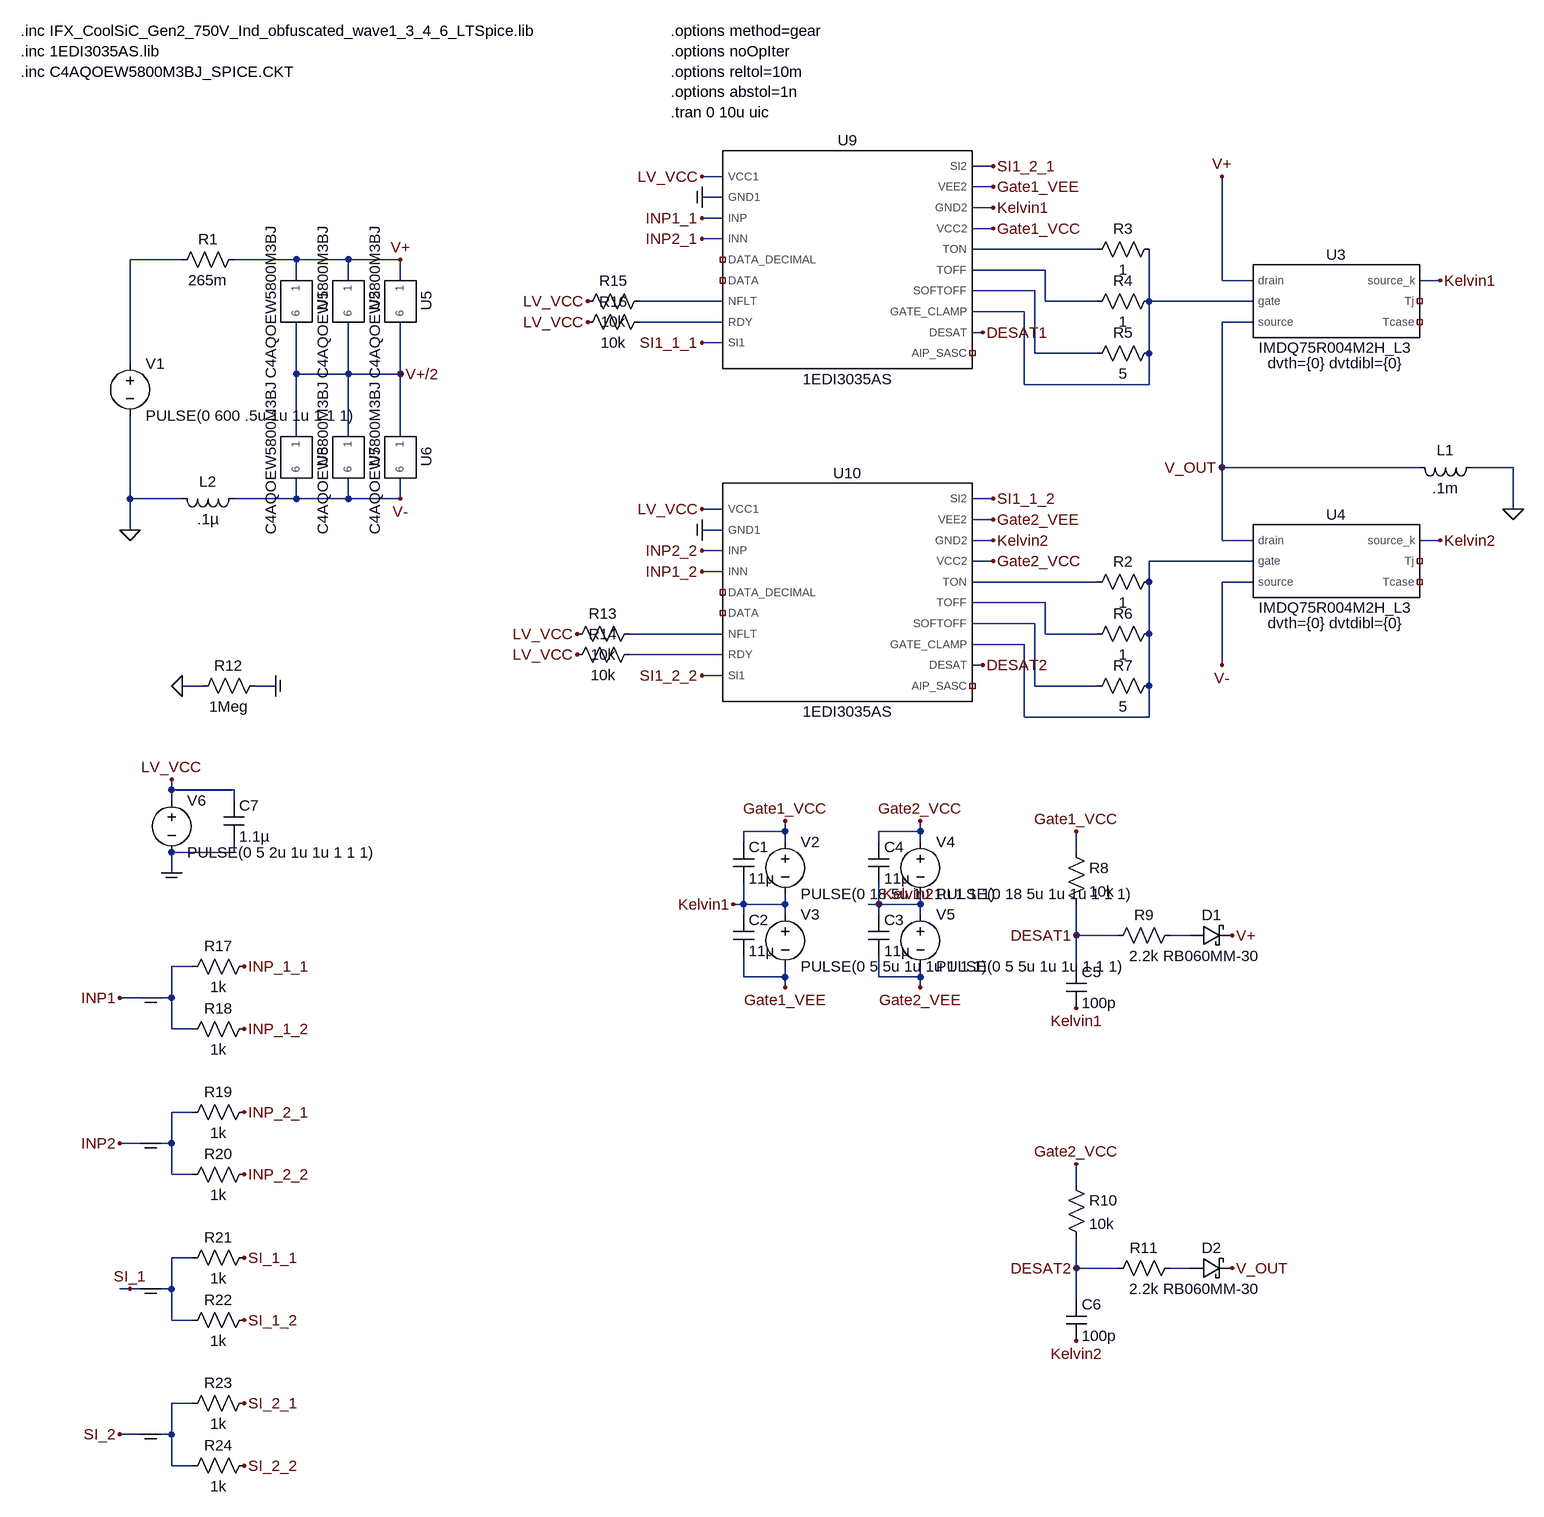
[diagram p0: schematic PowerSim.asc]
PowerSim.asc, the LTspice schematic file:
Version 4
SHEET 1 1312 2000
WIRE 496 -48 464 -48
WIRE 80 -32 48 -32
WIRE 496 -16 464 -16
WIRE 80 0 48 0
WIRE 496 16 464 16
WIRE 80 32 48 32
WIRE 496 48 464 48
WIRE 80 64 48 64
WIRE 656 80 464 80
WIRE -752 96 -832 96
WIRE -576 96 -672 96
WIRE -496 96 -576 96
WIRE -416 96 -496 96
WIRE 576 112 464 112
WIRE -576 128 -576 96
WIRE -496 128 -496 96
WIRE -416 128 -416 96
WIRE 848 128 848 -32
WIRE 896 128 848 128
WIRE 1184 128 1152 128
WIRE 560 144 464 144
WIRE 80 160 -48 160
WIRE 576 160 576 112
WIRE 656 160 576 160
WIRE 736 160 736 80
WIRE 896 160 736 160
WIRE 544 176 464 176
WIRE 80 192 -48 192
WIRE 896 192 848 192
WIRE 480 208 464 208
WIRE 80 224 48 224
WIRE 560 240 560 144
WIRE 656 240 560 240
WIRE 736 240 736 160
WIRE -832 256 -832 96
WIRE -576 272 -576 192
WIRE -496 272 -496 192
WIRE -496 272 -576 272
WIRE -416 272 -416 192
WIRE -416 272 -496 272
WIRE 544 288 544 176
WIRE 736 288 736 240
WIRE 736 288 544 288
WIRE -576 368 -576 272
WIRE -496 368 -496 272
WIRE -416 368 -416 272
WIRE 848 416 848 192
WIRE 1152 416 848 416
WIRE 1296 416 1232 416
WIRE -832 464 -832 336
WIRE -752 464 -832 464
WIRE -576 464 -576 432
WIRE -576 464 -672 464
WIRE -496 464 -496 432
WIRE -496 464 -576 464
WIRE -416 464 -416 432
WIRE -416 464 -496 464
WIRE 496 464 464 464
WIRE 80 480 48 480
WIRE 1296 480 1296 416
WIRE 496 496 464 496
WIRE -832 512 -832 464
WIRE 80 512 48 512
WIRE 496 528 464 528
WIRE 848 528 848 416
WIRE 896 528 848 528
WIRE 1184 528 1152 528
WIRE 80 544 48 544
WIRE 496 560 464 560
WIRE 896 560 736 560
WIRE 80 576 48 576
WIRE 656 592 464 592
WIRE 736 592 736 560
WIRE 896 592 848 592
WIRE 576 624 464 624
WIRE 560 656 464 656
WIRE 80 672 -64 672
WIRE 576 672 576 624
WIRE 656 672 576 672
WIRE 736 672 736 592
WIRE 544 688 464 688
WIRE 80 704 -64 704
WIRE 480 720 464 720
WIRE 848 720 848 592
WIRE 80 736 48 736
WIRE -720 752 -752 752
WIRE -608 752 -640 752
WIRE 560 752 560 656
WIRE 656 752 560 752
WIRE 736 752 736 672
WIRE 544 800 544 688
WIRE 736 800 736 752
WIRE 736 800 544 800
WIRE -768 912 -768 896
WIRE -672 912 -768 912
WIRE -768 928 -768 912
WIRE -672 928 -672 912
WIRE 176 976 176 960
WIRE 176 976 112 976
WIRE 384 976 384 960
WIRE 384 976 320 976
WIRE 112 992 112 976
WIRE 176 992 176 976
WIRE 320 992 320 976
WIRE 384 992 384 976
WIRE -672 1008 -672 992
WIRE -672 1008 -768 1008
WIRE 624 1008 624 976
WIRE -768 1040 -768 1008
WIRE 112 1088 112 1056
WIRE 112 1088 96 1088
WIRE 176 1088 176 1072
WIRE 176 1088 112 1088
WIRE 320 1088 320 1056
WIRE 320 1088 304 1088
WIRE 384 1088 384 1072
WIRE 384 1088 320 1088
WIRE 112 1104 112 1088
WIRE 176 1104 176 1088
WIRE 320 1104 320 1088
WIRE 384 1104 384 1088
WIRE 624 1136 624 1088
WIRE 688 1136 624 1136
WIRE 800 1136 768 1136
WIRE -736 1184 -768 1184
WIRE 624 1184 624 1136
WIRE 112 1200 112 1168
WIRE 176 1200 176 1184
WIRE 176 1200 112 1200
WIRE 320 1200 320 1168
WIRE 384 1200 384 1184
WIRE 384 1200 320 1200
WIRE 176 1216 176 1200
WIRE 384 1216 384 1200
WIRE -800 1232 -848 1232
WIRE -768 1232 -768 1184
WIRE -768 1232 -800 1232
WIRE -768 1280 -768 1232
WIRE -736 1280 -768 1280
WIRE -736 1408 -768 1408
WIRE -800 1456 -848 1456
WIRE -768 1456 -768 1408
WIRE -768 1456 -800 1456
WIRE -768 1504 -768 1456
WIRE -736 1504 -768 1504
WIRE 624 1520 624 1488
WIRE -736 1632 -768 1632
WIRE 624 1648 624 1600
WIRE 688 1648 624 1648
WIRE 800 1648 768 1648
WIRE -832 1680 -848 1680
WIRE -800 1680 -832 1680
WIRE -768 1680 -768 1632
WIRE -768 1680 -800 1680
WIRE 624 1696 624 1648
WIRE -768 1728 -768 1680
WIRE -736 1728 -768 1728
WIRE -736 1856 -768 1856
WIRE -800 1904 -848 1904
WIRE -768 1904 -768 1856
WIRE -768 1904 -800 1904
WIRE -768 1952 -768 1904
WIRE -736 1952 -768 1952
FLAG -832 512 0
FLAG 1296 480 0
FLAG -416 96 V+
FLAG -416 464 V-
FLAG 848 -32 V+
FLAG 848 720 V-
FLAG -416 272 V+/2
FLAG 48 32 INP1_1
FLAG 48 544 INP2_2
FLAG 48 576 INP1_2
FLAG 48 64 INP2_1
FLAG 48 736 SI1_2_2
FLAG 48 224 SI1_1_1
FLAG 496 464 SI1_1_2
FLAG 496 -48 SI1_2_1
FLAG 1184 128 Kelvin1
FLAG 1184 528 Kelvin2
FLAG 496 528 Kelvin2
FLAG 496 16 Kelvin1
FLAG 496 48 Gate1_VCC
FLAG 496 -16 Gate1_VEE
FLAG 496 496 Gate2_VEE
FLAG 496 560 Gate2_VCC
FLAG 96 1088 Kelvin1
FLAG 320 1088 Kelvin2
FLAG 176 960 Gate1_VCC
FLAG 176 1216 Gate1_VEE
FLAG 384 960 Gate2_VCC
FLAG 384 1216 Gate2_VEE
FLAG 624 976 Gate1_VCC
FLAG 624 1248 Kelvin1
FLAG 864 1136 V+
FLAG 624 1488 Gate2_VCC
FLAG 624 1760 Kelvin2
FLAG 864 1648 V_OUT
FLAG 480 208 DESAT1
FLAG 480 720 DESAT2
FLAG 624 1136 DESAT1
FLAG 624 1648 DESAT2
FLAG 848 416 V_OUT
FLAG 48 512 COM
FLAG 48 0 COM
FLAG -752 752 0
FLAG -608 752 COM
FLAG 48 -32 LV_VCC
FLAG 48 480 LV_VCC
FLAG -768 896 LV_VCC
FLAG -768 1040 COM
FLAG -144 672 LV_VCC
FLAG -144 704 LV_VCC
FLAG -128 160 LV_VCC
FLAG -128 192 LV_VCC
FLAG -656 1184 INP_1_1
FLAG -656 1280 INP_1_2
FLAG -656 1408 INP_2_1
FLAG -656 1504 INP_2_2
FLAG -656 1632 SI_1_1
FLAG -656 1728 SI_1_2
FLAG -656 1856 SI_2_1
FLAG -656 1952 SI_2_2
FLAG -848 1232 INP1
FLAG -848 1456 INP2
FLAG -832 1680 SI_1
FLAG -848 1904 SI_2
FLAG -800 1232 COM
FLAG -800 1456 COM
FLAG -800 1680 COM
FLAG -800 1904 COM
SYMBOL voltage -832 240 R0
SYMATTR InstName V1
SYMATTR Value PULSE(0 600 .5u 1u 1u 1 1 1)
SYMBOL Infineon-SiCFETs/IMDQ75R004M2H_L3 1024 160 R0
SYMATTR InstName U3
SYMBOL Infineon-SiCFETs/IMDQ75R004M2H_L3 1024 560 R0
SYMATTR InstName U4
SYMBOL ind 1248 400 R90
WINDOW 0 5 56 VBottom 2
WINDOW 3 32 56 VTop 2
SYMATTR InstName L1
SYMATTR Value .1m
SYMATTR SpiceLine Rser=.1m
SYMBOL AutoGenerated/C4AQOEW5800M3BJ -576 160 R90
SYMATTR InstName U1
SYMBOL AutoGenerated/C4AQOEW5800M3BJ -496 160 R90
SYMATTR InstName U2
SYMBOL AutoGenerated/C4AQOEW5800M3BJ -416 160 R90
SYMATTR InstName U5
SYMBOL AutoGenerated/C4AQOEW5800M3BJ -416 400 R90
SYMATTR InstName U6
SYMBOL AutoGenerated/C4AQOEW5800M3BJ -496 400 R90
SYMATTR InstName U7
SYMBOL AutoGenerated/C4AQOEW5800M3BJ -576 400 R90
SYMATTR InstName U8
SYMBOL res -656 80 R90
WINDOW 0 0 56 VBottom 2
WINDOW 3 32 56 VTop 2
SYMATTR InstName R1
SYMATTR Value 265m
SYMBOL ind -656 448 R90
WINDOW 0 5 56 VBottom 2
WINDOW 3 32 56 VTop 2
SYMATTR InstName L2
SYMATTR Value .1µ
SYMBOL AutoGenerated/1EDI3035AS 272 96 R0
SYMATTR InstName U9
SYMBOL AutoGenerated/1EDI3035AS 272 608 R0
SYMATTR InstName U10
SYMBOL voltage 176 976 R0
SYMATTR InstName V2
SYMATTR Value PULSE(0 18 5u 1u 1u 1 1 1)
SYMBOL voltage 176 1088 R0
SYMATTR InstName V3
SYMATTR Value PULSE(0 5 5u 1u 1u 1 1 1)
SYMBOL voltage 384 976 R0
SYMATTR InstName V4
SYMATTR Value PULSE(0 18 5u 1u 1u 1 1 1)
SYMBOL voltage 384 1088 R0
SYMATTR InstName V5
SYMATTR Value PULSE(0 5 5u 1u 1u 1 1 1)
SYMBOL Res 752 64 R90
WINDOW 0 0 56 VBottom 2
WINDOW 3 32 56 VTop 2
SYMATTR InstName R3
SYMATTR Value 1
SYMBOL Res 752 144 R90
WINDOW 0 0 56 VBottom 2
WINDOW 3 32 56 VTop 2
SYMATTR InstName R4
SYMATTR Value 1
SYMBOL Res 752 224 R90
WINDOW 0 0 56 VBottom 2
WINDOW 3 32 56 VTop 2
SYMATTR InstName R5
SYMATTR Value 5
SYMBOL cap 96 992 R0
SYMATTR InstName C1
SYMATTR Value 11µ
SYMBOL cap 96 1104 R0
SYMATTR InstName C2
SYMATTR Value 11µ
SYMBOL cap 304 1104 R0
SYMATTR InstName C3
SYMATTR Value 11µ
SYMBOL cap 304 992 R0
SYMATTR InstName C4
SYMATTR Value 11µ
SYMBOL Res 752 576 R90
WINDOW 0 0 56 VBottom 2
WINDOW 3 32 56 VTop 2
SYMATTR InstName R2
SYMATTR Value 1
SYMBOL Res 752 656 R90
WINDOW 0 0 56 VBottom 2
WINDOW 3 32 56 VTop 2
SYMATTR InstName R6
SYMATTR Value 1
SYMBOL Res 752 736 R90
WINDOW 0 0 56 VBottom 2
WINDOW 3 32 56 VTop 2
SYMATTR InstName R7
SYMATTR Value 5
SYMBOL res 608 992 R0
SYMATTR InstName R8
SYMATTR Value 10k
SYMBOL res 784 1120 R90
WINDOW 0 0 56 VBottom 2
WINDOW 3 32 56 VTop 2
SYMATTR InstName R9
SYMATTR Value 2.2k
SYMBOL cap 608 1184 R0
SYMATTR InstName C5
SYMATTR Value 100p
SYMBOL schottky 800 1152 R270
WINDOW 0 32 32 VTop 2
WINDOW 3 0 32 VBottom 2
SYMATTR InstName D1
SYMATTR Value RB060MM-30
SYMATTR Description Diode
SYMATTR Type diode
SYMBOL res 608 1504 R0
SYMATTR InstName R10
SYMATTR Value 10k
SYMBOL res 784 1632 R90
WINDOW 0 0 56 VBottom 2
WINDOW 3 32 56 VTop 2
SYMATTR InstName R11
SYMATTR Value 2.2k
SYMBOL cap 608 1696 R0
SYMATTR InstName C6
SYMATTR Value 100p
SYMBOL schottky 800 1664 R270
WINDOW 0 32 32 VTop 2
WINDOW 3 0 32 VBottom 2
SYMATTR InstName D2
SYMATTR Value RB060MM-30
SYMATTR Description Diode
SYMATTR Type diode
SYMBOL res -624 736 R90
WINDOW 0 0 56 VBottom 2
WINDOW 3 32 56 VTop 2
SYMATTR InstName R12
SYMATTR Value 1Meg
SYMBOL voltage -768 912 R0
SYMATTR InstName V6
SYMATTR Value PULSE(0 5 2u 1u 1u 1 1 1)
SYMBOL cap -688 928 R0
SYMATTR InstName C7
SYMATTR Value 1.1µ
SYMBOL res -48 656 R90
WINDOW 0 0 56 VBottom 2
WINDOW 3 32 56 VTop 2
SYMATTR InstName R13
SYMATTR Value 10k
SYMBOL res -48 688 R90
WINDOW 0 0 56 VBottom 2
WINDOW 3 32 56 VTop 2
SYMATTR InstName R14
SYMATTR Value 10k
SYMBOL res -32 144 R90
WINDOW 0 0 56 VBottom 2
WINDOW 3 32 56 VTop 2
SYMATTR InstName R15
SYMATTR Value 10k
SYMBOL res -32 176 R90
WINDOW 0 0 56 VBottom 2
WINDOW 3 32 56 VTop 2
SYMATTR InstName R16
SYMATTR Value 10k
SYMBOL res -640 1168 R90
WINDOW 0 0 56 VBottom 2
WINDOW 3 32 56 VTop 2
SYMATTR InstName R17
SYMATTR Value 1k
SYMBOL res -640 1264 R90
WINDOW 0 0 56 VBottom 2
WINDOW 3 32 56 VTop 2
SYMATTR InstName R18
SYMATTR Value 1k
SYMBOL res -640 1392 R90
WINDOW 0 0 56 VBottom 2
WINDOW 3 32 56 VTop 2
SYMATTR InstName R19
SYMATTR Value 1k
SYMBOL res -640 1488 R90
WINDOW 0 0 56 VBottom 2
WINDOW 3 32 56 VTop 2
SYMATTR InstName R20
SYMATTR Value 1k
SYMBOL res -640 1616 R90
WINDOW 0 0 56 VBottom 2
WINDOW 3 32 56 VTop 2
SYMATTR InstName R21
SYMATTR Value 1k
SYMBOL res -640 1712 R90
WINDOW 0 0 56 VBottom 2
WINDOW 3 32 56 VTop 2
SYMATTR InstName R22
SYMATTR Value 1k
SYMBOL res -640 1840 R90
WINDOW 0 0 56 VBottom 2
WINDOW 3 32 56 VTop 2
SYMATTR InstName R23
SYMATTR Value 1k
SYMBOL res -640 1936 R90
WINDOW 0 0 56 VBottom 2
WINDOW 3 32 56 VTop 2
SYMATTR InstName R24
SYMATTR Value 1k
TEXT 0 -256 Left 2 !.options method=gear\n.options noOpIter\n.options reltol=10m\n.options abstol=1n\n.tran 0 10u uic
TEXT -1000 -256 Left 2 !.inc IFX_CoolSiC_Gen2_750V_Ind_obfuscated_wave1_3_4_6_LTSpice.lib\n.inc 1EDI3035AS.lib\n.inc C4AQOEW5800M3BJ_SPICE.CKT

The netlist it stands for:
* PowerSim.asc
V1 N002 0 PULSE(0 600 .5u 1u 1u 1 1 1)
XU3 V+ N006 V_OUT Kelvin1 NC_01 NC_02 IMDQ75R004M2H_L3 dvth={0} dvtdibl={0}  ; pins drain gate source source_k Tj Tcase
XU4 V_OUT N008 V- Kelvin2 NC_03 NC_04 IMDQ75R004M2H_L3 dvth={0} dvtdibl={0}  ; pins drain gate source source_k Tj Tcase
L1 0 V_OUT .1m Rser=.1m
XU1 V+ V+/2 C4AQOEW5800M3BJ  ; pins 1 6
XU2 V+ V+/2 C4AQOEW5800M3BJ  ; pins 1 6
XU5 V+ V+/2 C4AQOEW5800M3BJ  ; pins 1 6
XU6 V+/2 V- C4AQOEW5800M3BJ  ; pins 1 6
XU7 V+/2 V- C4AQOEW5800M3BJ  ; pins 1 6
XU8 V+/2 V- C4AQOEW5800M3BJ  ; pins 1 6
R1 V+ N002 265m
L2 V- 0 .1µ
XU9 LV_VCC SI_2 INP1_1 INP2_1 NC_05 NC_06 N005 N007 SI1_1_1 SI1_2_1 Gate1_VEE Kelvin1 Gate1_VCC N001 N003 N004 N006 DESAT1 NC_07 1EDI3035AS  ; pins VCC1 GND1 INP INN DATA_DECIMAL DATA NFLT RDY SI1 SI2 VEE2 GND2 VCC2 TON TOFF SOFTOFF GATE_CLAMP DESAT AIP_SASC
XU10 LV_VCC SI_2 INP2_2 INP1_2 NC_08 NC_09 N012 N013 SI1_2_2 SI1_1_2 Gate2_VEE Kelvin2 Gate2_VCC N009 N010 N011 N008 DESAT2 NC_10 1EDI3035AS  ; pins VCC1 GND1 INP INN DATA_DECIMAL DATA NFLT RDY SI1 SI2 VEE2 GND2 VCC2 TON TOFF SOFTOFF GATE_CLAMP DESAT AIP_SASC
V2 Gate1_VCC Kelvin1 PULSE(0 18 5u 1u 1u 1 1 1)
V3 Kelvin1 Gate1_VEE PULSE(0 5 5u 1u 1u 1 1 1)
V4 Gate2_VCC Kelvin2 PULSE(0 18 5u 1u 1u 1 1 1)
V5 Kelvin2 Gate2_VEE PULSE(0 5 5u 1u 1u 1 1 1)
R3 N006 N001 1
R4 N006 N003 1
R5 N006 N004 5
C1 Gate1_VCC Kelvin1 11µ
C2 Kelvin1 Gate1_VEE 11µ
C3 Kelvin2 Gate2_VEE 11µ
C4 Gate2_VCC Kelvin2 11µ
R2 N008 N009 1
R6 N008 N010 1
R7 N008 N011 5
R8 Gate1_VCC DESAT1 10k
R9 N014 DESAT1 2.2k
C5 DESAT1 Kelvin1 100p
D1 N014 V+ RB060MM-30
R10 Gate2_VCC DESAT2 10k
R11 N015 DESAT2 2.2k
C6 DESAT2 Kelvin2 100p
D2 N015 V_OUT RB060MM-30
R12 SI_2 0 1Meg
V6 LV_VCC SI_2 PULSE(0 5 2u 1u 1u 1 1 1)
C7 LV_VCC SI_2 1.1µ
R13 N012 LV_VCC 10k
R14 N013 LV_VCC 10k
R15 N005 LV_VCC 10k
R16 N007 LV_VCC 10k
R17 INP_1_1 SI_2 1k
R18 INP_1_2 SI_2 1k
R19 INP_2_1 SI_2 1k
R20 INP_2_2 SI_2 1k
R21 SI_1_1 SI_2 1k
R22 SI_1_2 SI_2 1k
R23 SI_2_1 SI_2 1k
R24 SI_2_2 SI_2 1k
.model D D
.lib standard.dio
.options method=gear
.options noOpIter
.options reltol=10m
.options abstol=1n
.tran 0 10u uic
.inc IFX_CoolSiC_Gen2_750V_Ind_obfuscated_wave1_3_4_6_LTSpice.lib
.inc 1EDI3035AS.lib
.inc C4AQOEW5800M3BJ_SPICE.CKT
.lib /Users/vladroiban/Documents/Inverter/LTSpice/C4AQOEW5800M3BJ_SPICE.CKT
.lib /Users/vladroiban/Documents/Inverter/LTSpice/1EDI3035AS.lib
.backanno
.end